# EAGLE schematic Devices (EAGLE 9.2.1)
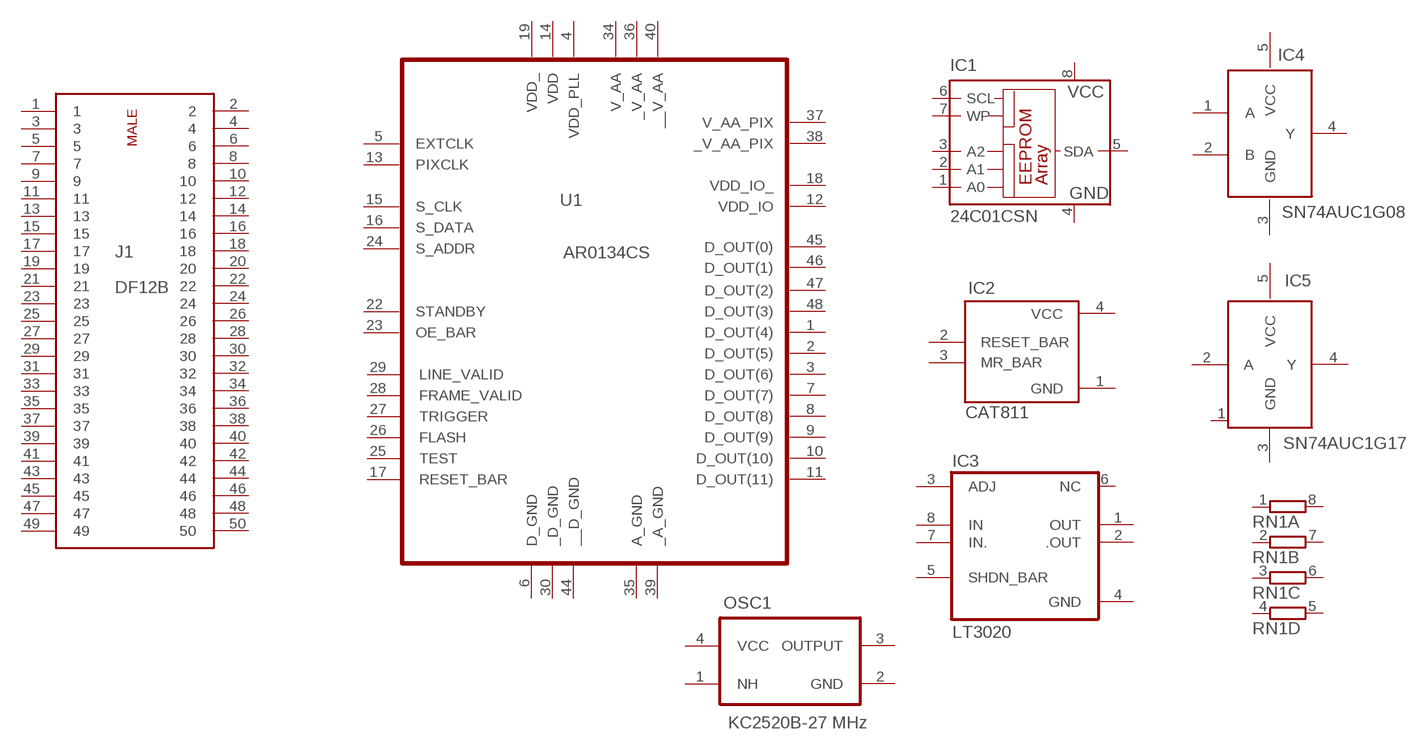
[diagram p0: schematic, sheet 1]

## Parts
IC1  24C01CSN  [SO-08]
IC2  CAT811  [SOT-143-4]
IC3  LT3020EMS8-ADJ  [MSOP8]
IC4  SN74AUC1G08  [SOT23-5]
IC5  SN74AUC1G17  [SOT23-5]
J1  DF12B(5.0)-50DS-0.5(86)SMT  [DF12B(5.0)-50DS-0.5V(86)]
OSC1  KC2520B-27MHZ  [2.5X2.0_SMDCRYSTAL]
RN1  4R-NEXB28V  [EXB28V]
U1  AR0134CS-ILCC48  [ILCC48]
Unconnected: IC1.1(A0) IC1.2(A1) IC1.3(A2) IC1.5(SDA) IC1.6(SCL) IC1.7(WP) IC2.1(GND) IC2.2(RESET_BAR) IC2.3(MR_BAR) IC2.4(VCC) IC3.1(OUT) IC3.2(.OUT) IC3.3(ADJ) IC3.4(GND) IC3.5(SHDN_BAR) IC3.6(NC) IC3.7(IN.) IC3.8(IN) IC4.1(A) IC4.2(B) IC4.3(GND) IC4.4(Y) IC4.5(VCC) IC5.1(NC) IC5.2(A) IC5.3(GND) IC5.4(Y) IC5.5(VCC) J1.1 J1.2 J1.3 J1.4 J1.5 J1.6 J1.7 J1.8 J1.9 J1.10 J1.11 J1.12 J1.13 J1.14 J1.15 J1.16 J1.17 J1.18 J1.19 J1.20 J1.21 J1.22 J1.23 J1.24 J1.25 J1.26 J1.27 J1.28 J1.29 J1.30 J1.31 J1.32 J1.33 J1.34 J1.35 J1.36 J1.37 J1.38 J1.39 J1.40 J1.41 J1.42 J1.43 J1.44 J1.45 J1.46 J1.47 J1.48 J1.49 J1.50 OSC1.1(NH) OSC1.2(GND) OSC1.3(OUTPUT) OSC1.4(VCC) RN1.1 RN1.2 RN1.3 RN1.4 RN1.5 RN1.6 RN1.7 RN1.8 U1.1(D_OUT(4)) U1.2(D_OUT(5)) U1.3(D_OUT(6)) U1.4(VDD_PLL) U1.5(EXTCLK) U1.6(D_GND) U1.7(D_OUT(7)) U1.8(D_OUT(8)) U1.9(D_OUT(9)) U1.10(D_OUT(10)) U1.11(D_OUT(11)) U1.12(VDD_IO) U1.13(PIXCLK) U1.14(VDD) U1.15(S_CLK) U1.16(S_DATA) U1.17(RESET_BAR) U1.18(VDD_IO_) U1.19(VDD_) U1.22(STANDBY) U1.23(OE_BAR) U1.24(S_ADDR) U1.25(TEST) U1.26(FLASH) U1.27(TRIGGER) U1.28(FRAME_VALID) U1.29(LINE_VALID) U1.30(_D_GND) U1.34(V_AA) U1.35(A_GND) U1.36(_V_AA) U1.37(V_AA_PIX) U1.38(_V_AA_PIX) U1.39(_A_GND) U1.40(__V_AA) U1.44(__D_GND) U1.45(D_OUT(0)) U1.46(D_OUT(1)) U1.47(D_OUT(2)) U1.48(D_OUT(3))

## Power pins joined to a net without a drawn wire
GND: IC1.4(GND)
VCC: IC1.8(VCC)

## Library data of the parts
IC1 = microchip:24C*: Serial EEPROM 1 K/2 K/4 K; MF: MICROCHIP; MPN: 24C01C/SN; OC_FARNELL: unknown; OC_NEWARK: 96K4061
IC2 = Sightline:CAT811: CAT811-SOT-143-4 IC, SUPERVISOR, MICROPROCESSOR POWER SUPPLY, 2.93V, ACTIVE LOW RESET, SOT143-4 Specifications Manufacturer: On Semiconductor Manufacturer Part Number: CAT811STBI Body Size(mm): 2.9 x 1.3 CAT811 DATASHEET <https://www.onsemi.com/pub/Collateral/CAT811-D.PDF> Created by: Kimball S. Davis 23 January 2019 Version 001; DESCRIPTION: IC, SUPERVISOR, MICROPROCESSOR POWER SUPPLY, 2.93V, ACTIVE LOW RESET, SOT143-4; MANF: On Semiconductor; MANF#: CAT811STBI
IC3 = Sightline:LT3020EMS8-ADJ: LT3020EMS8-ADJ-MSOP8 IC, VOLTAGE REGULATOR, POSITIVE, VLDO, ADJ, 100mA, 0.2 TO 9.5V OUTPUT, MSOP8 Specifications Manufacturer: Linear Technology Manufacturer Part Number: LT302OEMS8#PBF Body Size(mm): 3 x 3 LT3020 DATASHEET <https://www.analog.com/media/en/technical-documentation/data-sheets/3020fc.pdf> Created by: Kimball S. Davis 22 January 2019 Version 001; DESCRIPTION: IC, VOLTAGE REGULATOR, POSITIVE, VLDO, ADJ, 100mA, 0.2 TO 9.5V OUTPUT, MSOP8; MANF: LINEAR TECHNOLOGY; MANF#: LT302OEMS8#PBF
IC4 = Sightline:SN74AUC1G08: SN74AUC1G08-SOT23-5 Single 2-Input Positive-AND Gate Specifications Manufacturer: Texas Instruments Manufacturer Part Number: SN74AUC1G08DBVR Supply Voltage: 1.65 - 1.95V Body Size(mm): 2.9 x 1.6 SN74AUC1G08 DATASHEET <http://www.ti.com/lit/ds/symlink/sn74auc1g08.pdf>; DESCRIPTION: IC, AND GATE, SINGLE, 2 INPUT POSITIVE, SGL, SOT23-5; MANF: Texas Instruments; MANF#: SN74AUC1G08DBVR
IC5 = Sightline:SN74AUC1G17: SN74AUC1G17-SOT23-5 IC, BUFFER, SINGLE SCHMITT-TRIGGER, 9mA, 0.8V TO 2.7V, SOT23-5 Specifications Manufacturer: Texas Instruments Manufacturer Part Number: SN74AUC1G17DBVR Supply Voltage: 3.6V Max Body Size(mm): 2.9 x 1.6 SN74AUC1G17 DATASHEET <http://www.ti.com/lit/ds/symlink/sn74auc1g17.pdf> Created by: Kimball S. Davis 24 January 2019 Version 001; DESCRIPTION: IC, BUFFER, SINGLE SCHMITT-TRIGGER, 9mA, 0.8V TO 2.7V, SOT23-5; MANF: TEXAS INSTRUMENTS; MANF#: SN74AUC1G17DBV
J1 = Sightline:DF12B(5.0)-50DS-0.5(86): DF12B(5.0)-50DS-0.5(86) DF12 Series 0.5 mm Pitch SMT Board-to-Board Connector (MALE) Specifications Manufacturer: Hirose Manufacturer Part Number: 537-0309-6 86 Operating Temperature Range(C): -45 - 125 Current Rating: 0.3A Voltage Rating: 50V AC Body Size(mm): 14.6 x 3.6 DF12B(5.0)-50DS DATASHEET <https://www.hirose.com/product/en/products/DF12/> Created by: Kimball S. Davis kimball4@pdx.edu <mailto: kimball4@pdx.edu> 21 January 2019 Version 001; DESCRIPTION: DF12B-50DS-0.5V(86) Hirose Male 50-pin connector; MANF: Hirose; MANF#: 537-0309-6 86
OSC1 = Sightline:KC2520B-27MHZ: KC2520B-27MHz-2.5X2.0 27 MHz SMT Clock Oscillator with CMOS output Specifications Manufacturer: Kyocera Manufacturer Part Number: KC2520B27.0000C2GE00 Supply Voltage: 1.8 to 3.3V Body Size(mm): 2.5 x 2.0 KC2520B DATASHEET <https://www.mouser.com/datasheet/2/909/kc2520b_c1_e-1388834.pdf> Created by: Kimball S. Davis 25 January 2019 Version 001; DESCRIPTION: OSC, CRYSTAL CLOCK, SMD, CMOS, 2.25V TO 3.63V, 4mA, 27.0000MHz, 2.5MM x 2.0MM; MANF: Kyocera; MANF#: KC2520B27.0000C2GE00
RN1 = resistor-dil:4R-N: Array Chip Resistor Source: RS Component / Phycomp; OC_FARNELL: unknown; OC_NEWARK: unknown
U1 = Sightline:AR0134CS-ILCC48: AR0134CS-1LCC48-10x10 1/3-inch 1.2 Mp CMOS digital image sensor with an active-pixel array of 1280 (H) × 960 (V) Specifications Manufacturer: On Semiconductor Manufacturer Part Number: AR0134CSSM00SPCA0 Operating Temperature Range(C): -30 - 70 Supply Voltage: I/O: 1.8 or 2.8V Digital: 1.8V Analog: 2.8V HiSPi: 0.4V Body Size(mm): 10 x 10 ARO134CS DATASHEET <https://www.onsemi.com/pub/Collateral/AR0134CS-D.PDF> Created by: Kimball S. Davis kimball4@pdx.edu <mailto: kimball4@pdx.edu> 22 January 2019 Version 001; DESCRIPTION: 1/3-inch 1.2 Mp CMOS digital image sensor with an active-pixel array of 1280 (H) × 960 (V); MANF: On Semiconductor; MANF#: AR0134CSSM00SPCA0